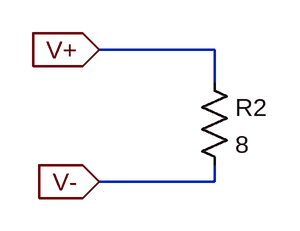
[diagram p0: schematic myspkr.asc]
myspkr.asc, the LTspice schematic file:
Version 4
SHEET 1 880 680
WIRE 352 96 240 96
WIRE 352 128 352 96
WIRE 352 224 352 208
WIRE 352 224 240 224
FLAG 240 224 V-
IOPIN 240 224 In
FLAG 240 96 V+
IOPIN 240 96 In
SYMBOL res 336 112 R0
SYMATTR InstName R2
SYMATTR Value 8

The netlist it stands for:
* myspkr.asc
R2 V+ V- 8
.backanno
.end